# EAGLE design LazuriteMiniDongle (EAGLE 7.6.0)
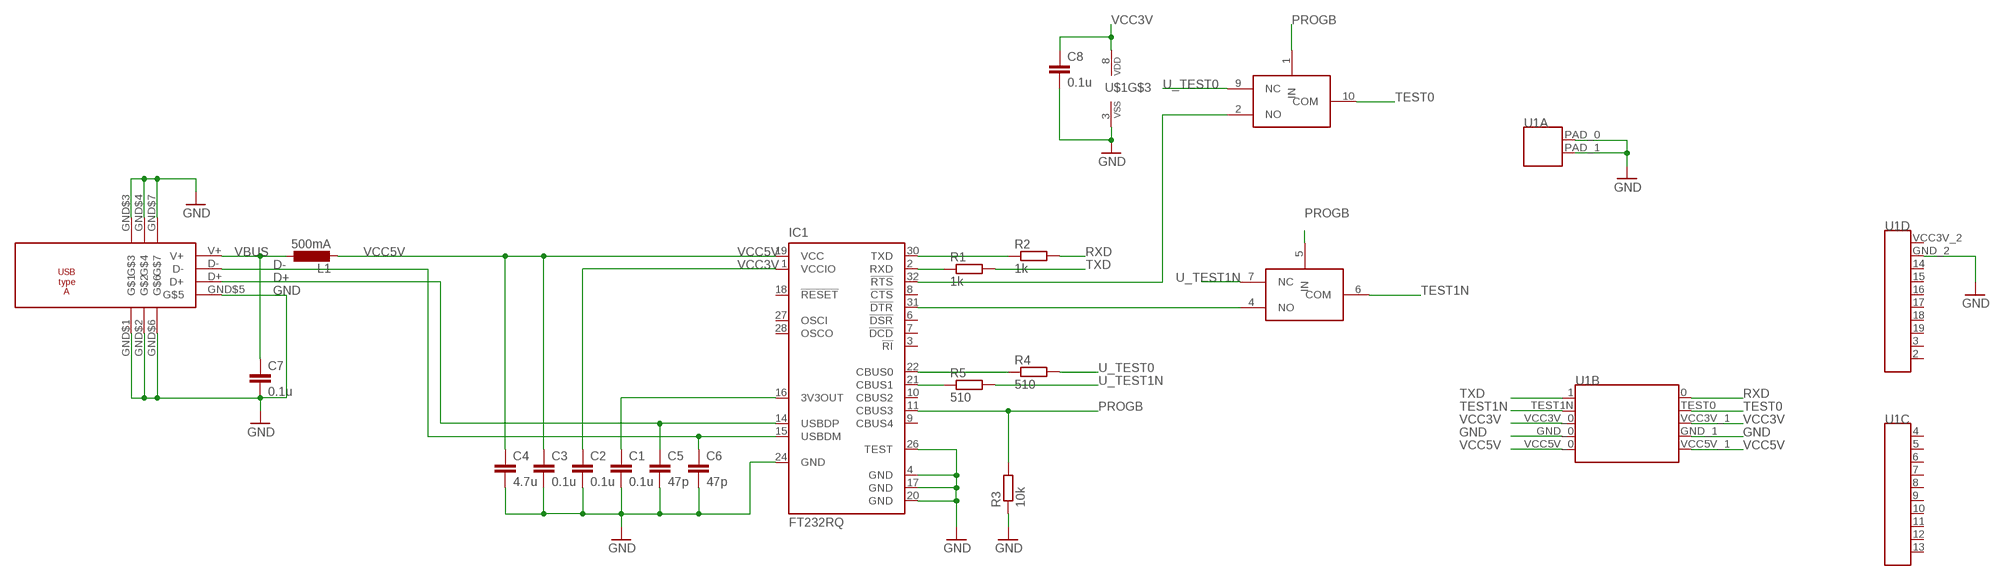
[diagram p0: schematic, sheet 1]

## Parts
C1  0.1u  C-EUC0402  [C0402]
C2  0.1u  C-EUC0402  [C0402]
C3  0.1u  C-EUC0402  [C0402]
C4  4.7u  C-EUC1608  [C1608]
C5  47p  C-EUC0402  [C0402]
C6  47p  C-EUC0402  [C0402]
C7  0.1u  C-EUC0402  [C0402]
C8  0.1u  C-EUC0402  [C0402]
IC1  FT232RQ  [QFN32]
L1  500mA  L-EUL1812  [L1812]
R1  1k  R-EU_R0402  [R0402]
R2  1k  R-EU_R0402  [R0402]
R3  10k  R-EU_R0402  [R0402]
R4  510  R-EU_R0402  [R0402]
R5  510  R-EU_R0402  [R0402]
U1  LAZURITE920JLAZURITE920J  [LAZURITE920J]
U$1  TI-TS5A23159  [UQFN10]
U$2  USB-TYPE-A  [UP2-AH-TH]

## Nets
D+: C5.1 IC1.14(USBDP) U$2.D+
D-: C6.1 IC1.15(USBDM) U$2.D-
GND: C1.2 C2.2 C3.2 C4.2 C5.2 C6.2 C7.2 C8.2 IC1.4(GND) IC1.17(GND) IC1.20(GND) IC1.24(GND) IC1.26(TEST) R3.1 U1.GND_0(B:GND_0) U1.GND_1(B:GND_1) U1.GND_2(D:GND_2) U1.PAD_0(A:PAD_0) U1.PAD_1(A:PAD_1) U$1.3(VSS) U$2.GND$1(G$1) U$2.GND$2(G$2) U$2.GND$3(G$3) U$2.GND$4(G$4) U$2.GND$5(G$5) U$2.GND$6(G$6) U$2.GND$7(G$7)
N$1: C1.1 IC1.16(3V3OUT)
N$3: IC1.32(!RTS) U$1.2(NO)
N$5: IC1.2(RXD) R1.1
N$6: IC1.30(TXD) R2.1
N$7: IC1.21(CBUS1) R5.1
N$8: IC1.22(CBUS0) R4.1
N$9: IC1.31(!DTR) U$1.4(NO)
PROGB: IC1.11(CBUS3) R3.2 U$1.1(IN) U$1.5(IN)
RXD: R2.2 U1.0
TEST0: U1.TEST0(B:TEST0) U$1.10(COM)
TEST1N: U1.TEST1N(B:TEST1N) U$1.6(COM)
TXD: R1.2 U1.1
U_TEST0: R4.2 U$1.9(NC)
U_TEST1N: R5.2 U$1.7(NC)
VBUS: C7.1 L1.1 U$2.V+
VCC3V: C2.1 C8.1 IC1.1(VCCIO) U1.VCC3V_0(B:VCC3V_0) U1.VCC3V_1(B:VCC3V_1) U$1.8(VDD)
VCC5V: C3.1 C4.1 IC1.19(VCC) L1.2 U1.VCC5V_0(B:VCC5V_0) U1.VCC5V_1(B:VCC5V_1)
Unconnected: IC1.3(!RI) IC1.6(!DSR) IC1.7(!DCD) IC1.8(!CTS) IC1.9(CBUS4) IC1.10(CBUS2) IC1.18(!RESET) IC1.27(OSCI) IC1.28(OSCO) U1.2 U1.3 U1.4 U1.5 U1.6 U1.7 U1.8 U1.9 U1.10 U1.11 U1.12 U1.13 U1.14 U1.15 U1.16 U1.17 U1.18 U1.19 U1.VCC3V_2(D:VCC3V_2)

## Library data of the parts
C1-C3 C5-C8 = rcl:C-EU: CAPACITOR, European symbol
C4 = resistor:C-EU: CAPACITOR, European symbol
IC1 = ftdichip:FT232R: Source: http://www.ftdichip.com/Documents/DataSheets/DS_FT232R_v104.pdf; MPN: FT232RQ; OC_FARNELL: 1146033; OC_NEWARK: 91K9919
L1 = rcl:L-EU: INDUCTOR, European symbol
R1-R5 = rcl:R-EU_: RESISTOR, European symbol
U1 = lazurite:LAZURITE920J: Lazurite 920J
U$1 = lz-shield:TI-TS5A23159
U$2 = lz-shield:USB-TYPE-A

## Board
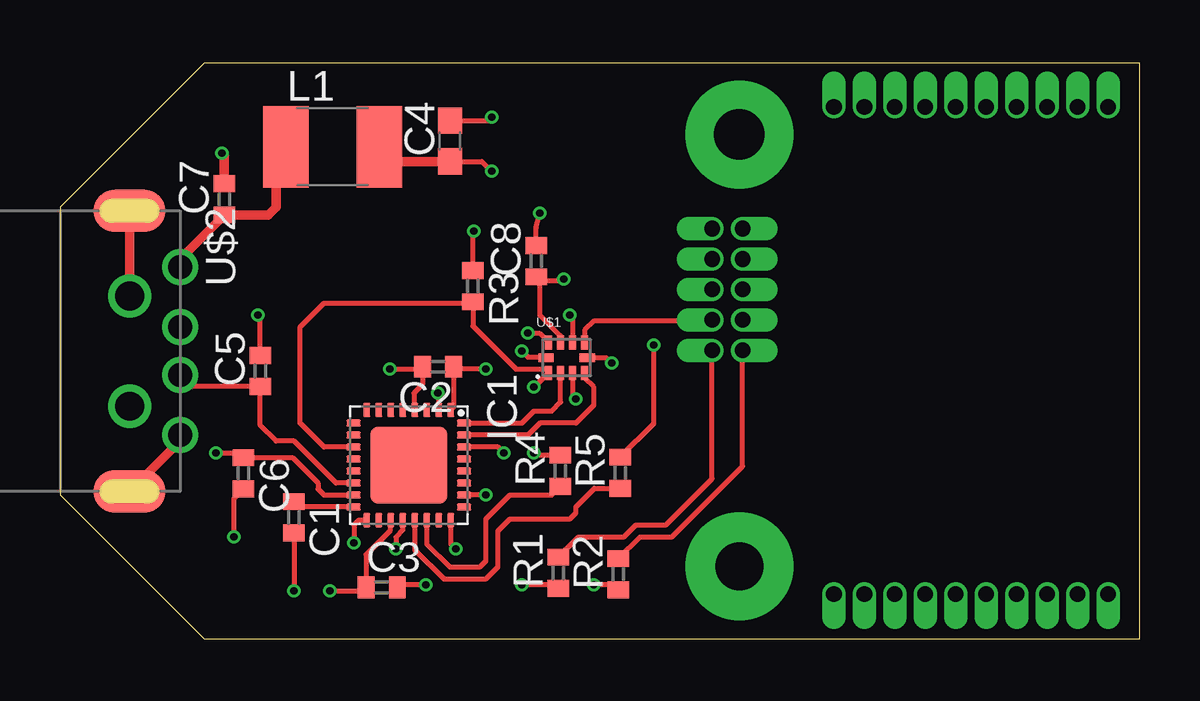
[diagram p1: board, top side]
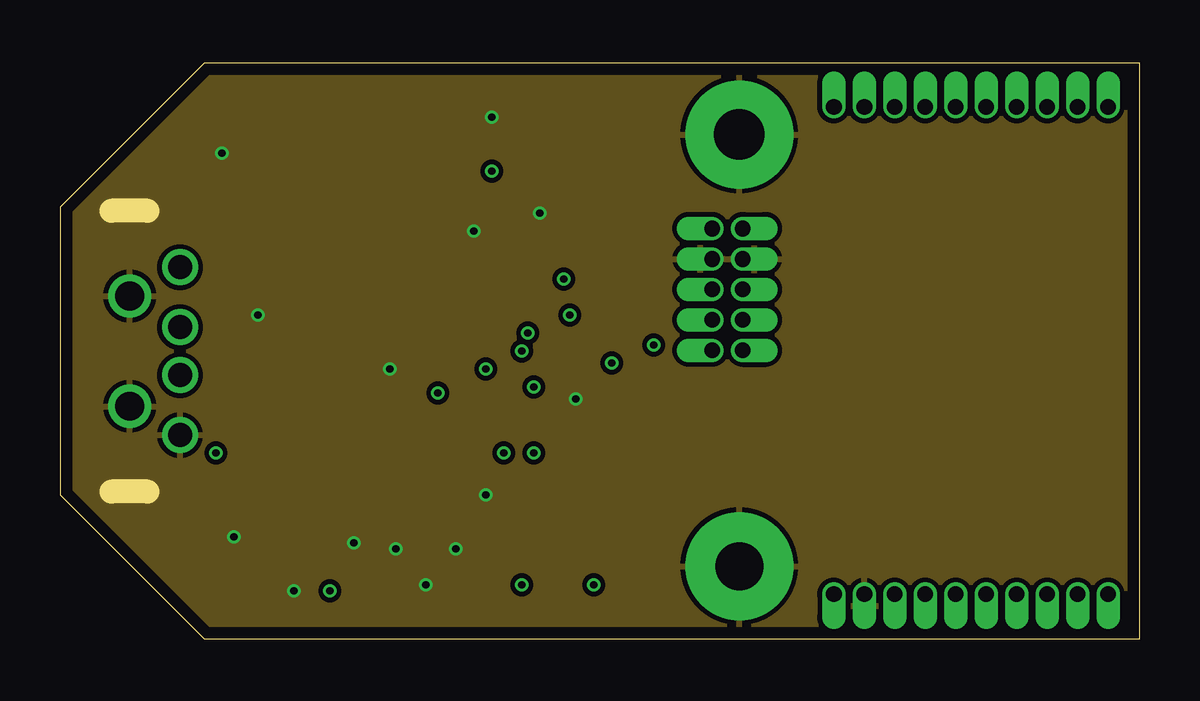
[diagram p2: board, inner layer Route2]
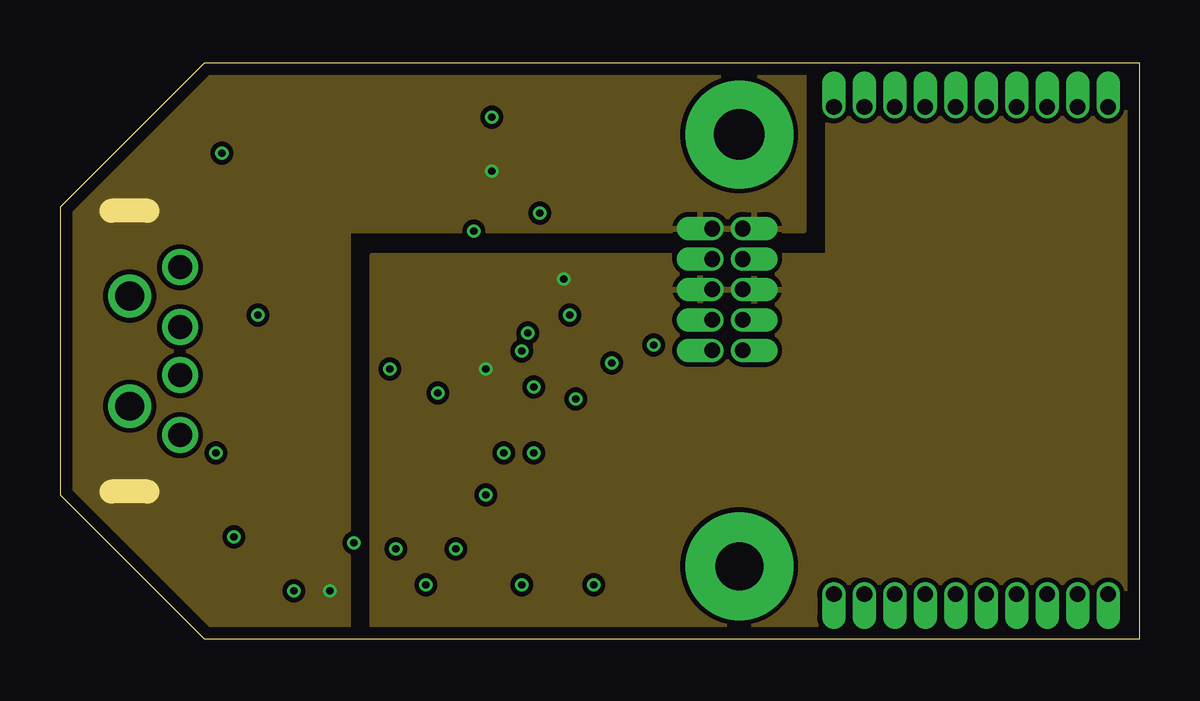
[diagram p3: board, inner layer Route3]
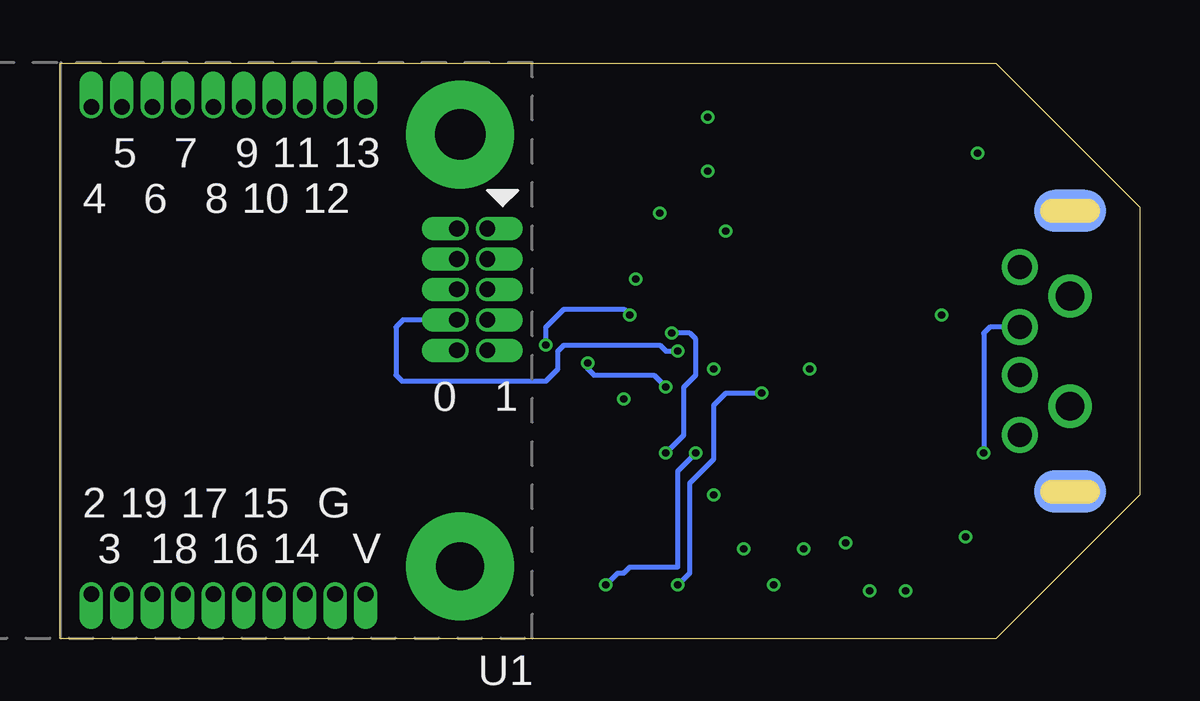
[diagram p4: board, bottom side, seen from below]

Size 45 x 24 mm. Coordinates in mm from the lower left corner, seen from the top.
Outline: 6,0 45,0 45,24 6,24 0,18 0,6 6,0
Copper layers (1+2*3+16): Top 0.018mm / dielectric 0.36mm / Route2 0.035mm / dielectric 0.71mm / Route3 0.035mm / dielectric 0.36mm / Bottom 0.018mm
Design rules "kpl_4_layer *": minimum track width 0.2mm, minimum drill 0.3mm, track to track 0.2mm, track to pad 0.2mm, pad to pad 0.2mm, via to via 0.2mm, smd to smd 0mil, copper to edge 0.5mm, drill to drill 0.2mm, minimum pad ring 0.125mm, minimum via ring 0.125mm, stop-mask expansion 2mil, vias tented up to drill 0.45mm, thermal gap 0.2mm

### Footprints (pad centres in the part's own frame; a part is rotated, then mirrored left to right if it is on the bottom)
C0402 = smd 0.7 x 0.9: 1 -0.65,0; 2 0.65,0
C1608 = smd 1.1 x 1: 1 -0.85,0; 2 0.85,0
QFN32 = smd 0.6 x 0.3: 1 -2.3,1.75; 2 -2.3,1.25; 3 -2.3,0.75; 4 -2.3,0.25; 5 -2.3,-0.25; 6 -2.3,-0.75; 7 -2.3,-1.25; 8 -2.3,-1.75; 17 2.3,-1.75; 18 2.3,-1.25; 19 2.3,-0.75; 20 2.3,-0.25; 21 2.3,0.25; 22 2.3,0.75; 23 2.3,1.25; 24 2.3,1.75 | smd 0.3 x 0.6: 9 -1.75,-2.3; 10 -1.25,-2.3; 11 -0.75,-2.3; 12 -0.25,-2.3; 13 0.25,-2.3; 14 0.75,-2.3; 15 1.25,-2.3; 16 1.75,-2.3; 25 1.75,2.3; 26 1.25,2.3; 27 0.75,2.3; 28 0.25,2.3; 29 -0.25,2.3; 30 -0.75,2.3; 31 -1.25,2.3; 32 -1.75,2.3 | smd 3.2 x 3.2: EXP 0,0
L1812 = smd 1.9 x 3.4: 1 -1.95,0; 2 1.95,0
R0402 = smd 0.7 x 0.9: 1 -0.65,0; 2 0.65,0
LAZURITE920J = drill 0.65 pad 0.8 offset: 0 1.27,5.08; 1 0,5.08; 2 16.51,15.24; 3 15.24,15.24; 4 16.51,-5.08; 5 15.24,-5.08; 6 13.97,-5.08; 7 12.7,-5.08; 8 11.43,-5.08; 9 10.16,-5.08; 10 8.89,-5.08; 11 7.62,-5.08; 12 6.35,-5.08; 13 5.08,-5.08; 14 7.62,15.24; 15 8.89,15.24; 16 10.16,15.24; 17 11.43,15.24; 18 12.7,15.24; 19 13.97,15.24; GND_0 0,1.27; GND_1 1.27,1.27; GND_2 6.35,15.24; TEST0 1.27,3.81; TEST1N 0,3.81; VCC3V_0 0,2.54; VCC3V_1 1.27,2.54; VCC3V_2 5.08,15.24; VCC5V_0 0,0; VCC5V_1 1.27,0 | drill 2.1 pad 4.5: PAD_0 1.135,-3.92 | drill 2 pad 4.5: PAD_1 1.135,14.08
UQFN10 = smd 0.3 x 0.58: 1 -0.75,-0.635; 2 -0.25,-0.635; 3 0.25,-0.635; 4 0.75,-0.635; 6 0.75,0.635; 7 0.25,0.635; 8 -0.25,0.635; 9 -0.75,0.635 | smd 0.63 x 0.35: 5 0.86,0; 10 -0.86,0
UP2-AH-TH = drill 1: D+ 1,5; D- -1,5; GND$7 3.5,5; V+ -3.5,5 | smd 1.75 x 3: GND$1 -5.85,2.9; GND$4 5.85,2.9 | smd 1.75 x 3 bottom: GND$2 -5.85,2.9; GND$3 5.85,2.9 | drill 1.2: GND$5 -2.3,2.9; GND$6 2.3,2.9

### Placement (x,y rotation side)
C1  9.75,5.07 270 top
C2  15.76,11.35 180 top
C3  13.41,2.15 0 top
C4  16.25,20.76 90 top
C5  8.35,11.17 90 top
C6  7.65,6.91 270 top
C7  6.85,18.33 90 top
C8  19.85,15.75 90 top
IC1  14.54,7.25 270 top
L1  11.36,20.52 0 top
R1  20.77,2.76 90 top
R2  23.27,2.7 90 top
R3  [R0402]  17.21,14.71 270 top
R4  20.85,7.01 90 top
R5  23.35,6.93 90 top
U1  27.18,17.11 180 bottom
U$1  21.12,11.73 0 top
U$2  0,12 270 top

### Tracks (layer width: path | path; a pad name or v marks a point on that pad's centre or on a via)
D+
  Top 0.2: U$2.D+ 5.48,10.52 C5.1 8.35,8.9 9,8.25 9.75,8.25 11.5,6.5 IC1.14
D-  (via drill 0.3)
  Top 0.2: IC1.15 11,6 10.75,6.25 10.75,6.5 9.69,7.56 C6.1 7.46,7.75 v6.5,7.75
  Bottom 0.2: U$2.D- 6.25,13 6.5,12.75 v6.5,7.75
GND  (via drill 0.3)  (2 unrouted)
  Top 0.2: C4.2 17.86,21.61 v18,21.75 | v13.75,11.25 15.01,11.25 C2.2 15.11,10.61 14.75,10.25 14.75,9.59 IC1.4 | v17.75,6 IC1.26 | v15.25,2.25 14.16,2.25 C3.2 | C8.2 19.85,17.15 v20,17.75 | C1.2 v9.75,2 | v7.25,4.25 7.25,5.86 C6.2 | C5.2 8.35,13.4 v8.25,13.5 | IC1.17 12.45,4.95 12.25,4.75 v12.25,4 | IC1.20 14.29,4.54 14,4.25 v14,3.75 | IC1.24 16.29,3.96 v16.5,3.75 | R3.1 17.21,16.96 v17.25,17 | U$1.3 21.37,10.13 v21.5,10
  Top 0.4: U$2.GND$7 5,8.25 U$2.GND$4 | U$2.GND$5 U$2.GND$2 | C7.2 6.85,20.15 v6.75,20.25
  pour Route2: 0,18 6,24 45,24 45,0 6,0 0,6
N$1
  Top 0.2: IC1.16 9.97,5.5 C1.1
N$3
  Top 0.2: IC1.32 19.25,9 19.75,9.5 20.5,9.5 20.87,9.87 U$1.2
N$5  (via drill 0.3)
  Top 0.2: R1.1 20.63,2.25 v19.25,2.25 | v15.75,10.25 15.79,10.21 IC1.2
  Bottom 0.2: v19.25,2.25 18.75,2.75 18.75,6.5 17.75,7.5 17.75,9.75 17.25,10.25 v15.75,10.25
N$6  (via drill 0.3)
  Top 0.2: R2.1 23.07,2.25 v22.25,2.25 | v18.5,7.75 18.25,8 IC1.30
  Bottom 0.2: v22.25,2.25 21.75,2.75 21.5,2.75 21.25,3 19.25,3 19.25,7 v18.5,7.75
N$7
  Top 0.2: IC1.21 14.79,3.71 16,2.5 17.75,2.5 18.25,3 18.25,4.5 18.75,5 21.25,5 21.5,5.25 21.5,5.5 22.28,6.28 R5.1
N$8
  Top 0.2: IC1.22 15.29,3.96 16.25,3 17.5,3 17.75,3.25 17.75,5 18.75,6 20.49,6 R4.1
N$9
  Top 0.2: IC1.31 19.5,8.5 20,9 21.5,9 22.25,9.75 22.25,10.5 21.87,10.88 U$1.4
PROGB  (via drill 0.3)
  Top 0.2: IC1.11 11,8 10,9 10,13 11,14 17.15,14 R3.2 17.21,13.04 19,11.25 20.21,11.25 U$1.1 19.77,10.5 v19.75,10.5 | U$1.5 22.77,11.73 v23,11.5
  Bottom 0.2: v23,11.5 23,11.25 22.75,11 20.25,11 v19.75,10.5
RXD
  Top 0.2: R2.2 24.17,4.25 25.5,4.25 28.45,7.2 U1.0
TEST0  (via drill 0.3)
  Top 0.2: v19.25,12 19.5,11.75 20.24,11.75 U$1.10
  Bottom 0.2: U1.TEST0 30.7,13.3 31,13 31,11 30.75,10.75 24.75,10.75 24.25,11.25 24.25,12 24,12.25 20,12.25 19.75,12 v19.25,12
TEST1N
  Top 0.2: U1.TEST1N 27.13,13.25 22.25,13.25 21.87,12.87 U$1.6
TXD
  Top 0.2: R1.2 21.61,4.25 23.5,4.25 24,4.75 25.25,4.75 27.18,6.68 U1.1
U_TEST0  (via drill 0.3)
  Top 0.2: v19.5,12.75 19.98,12.75 U$1.9 | R4.2 19.84,7.66 v19.75,7.75
  Bottom 0.2: v19.75,7.75 19,8.5 19,10.5 18.5,11 18.5,12.5 18.75,12.75 v19.5,12.75
U_TEST1N  (via drill 0.3)
  Top 0.2: v21.25,13.5 21.37,13.38 U$1.7 | R5.2 24.75,8.98 v24.75,12.25
  Bottom 0.2: v24.75,12.25 24.75,13 24,13.75 21.5,13.75 v21.25,13.5
VBUS
  Top 0.4: U$2.V+ 5,15.83 C7.1 8.68,17.68 9,18 9,20.11 L1.1
VCC3V  (via drill 0.3)
  Top 0.2: IC1.1 16.41,9.67 C2.1 16.51,11.25 v17.75,11.25 | U$1.8 20.87,12.63 20,13.5 20,14.95 | 20,14.95 C8.1 | 20,14.95 20.95,14.95 v21,15
  pour Route3: 13,16 32,16 32,24 45,24 45,0 13,0
VCC5V  (via drill 0.3)
  Top 0.2: C4.1 17.59,19.91 v18,19.5 | v11.25,2 12.61,2 C3.1 | C3.1 12.76,2.51 | IC1.19 13.75,4.91 13.75,4.5 12.76,3.51 C3.1
  Top 0.4: C4.1 13.92,19.91 L1.2
  pour Route3: 0,18 6,24 31,24 31,17 12,17 12,0 6,0 0,6